# Altium schematic sheet JETSON AGX UPHY.SchDoc: Jetson AGX - UPHY
size 431 x 279 mm; CheckedBy: Lance Bantoto; Engineer: Cindy Li, Chealsie Bains; DocumentNumber: 9; Revision: 1; SheetNumber: 9; SheetTotal: 23
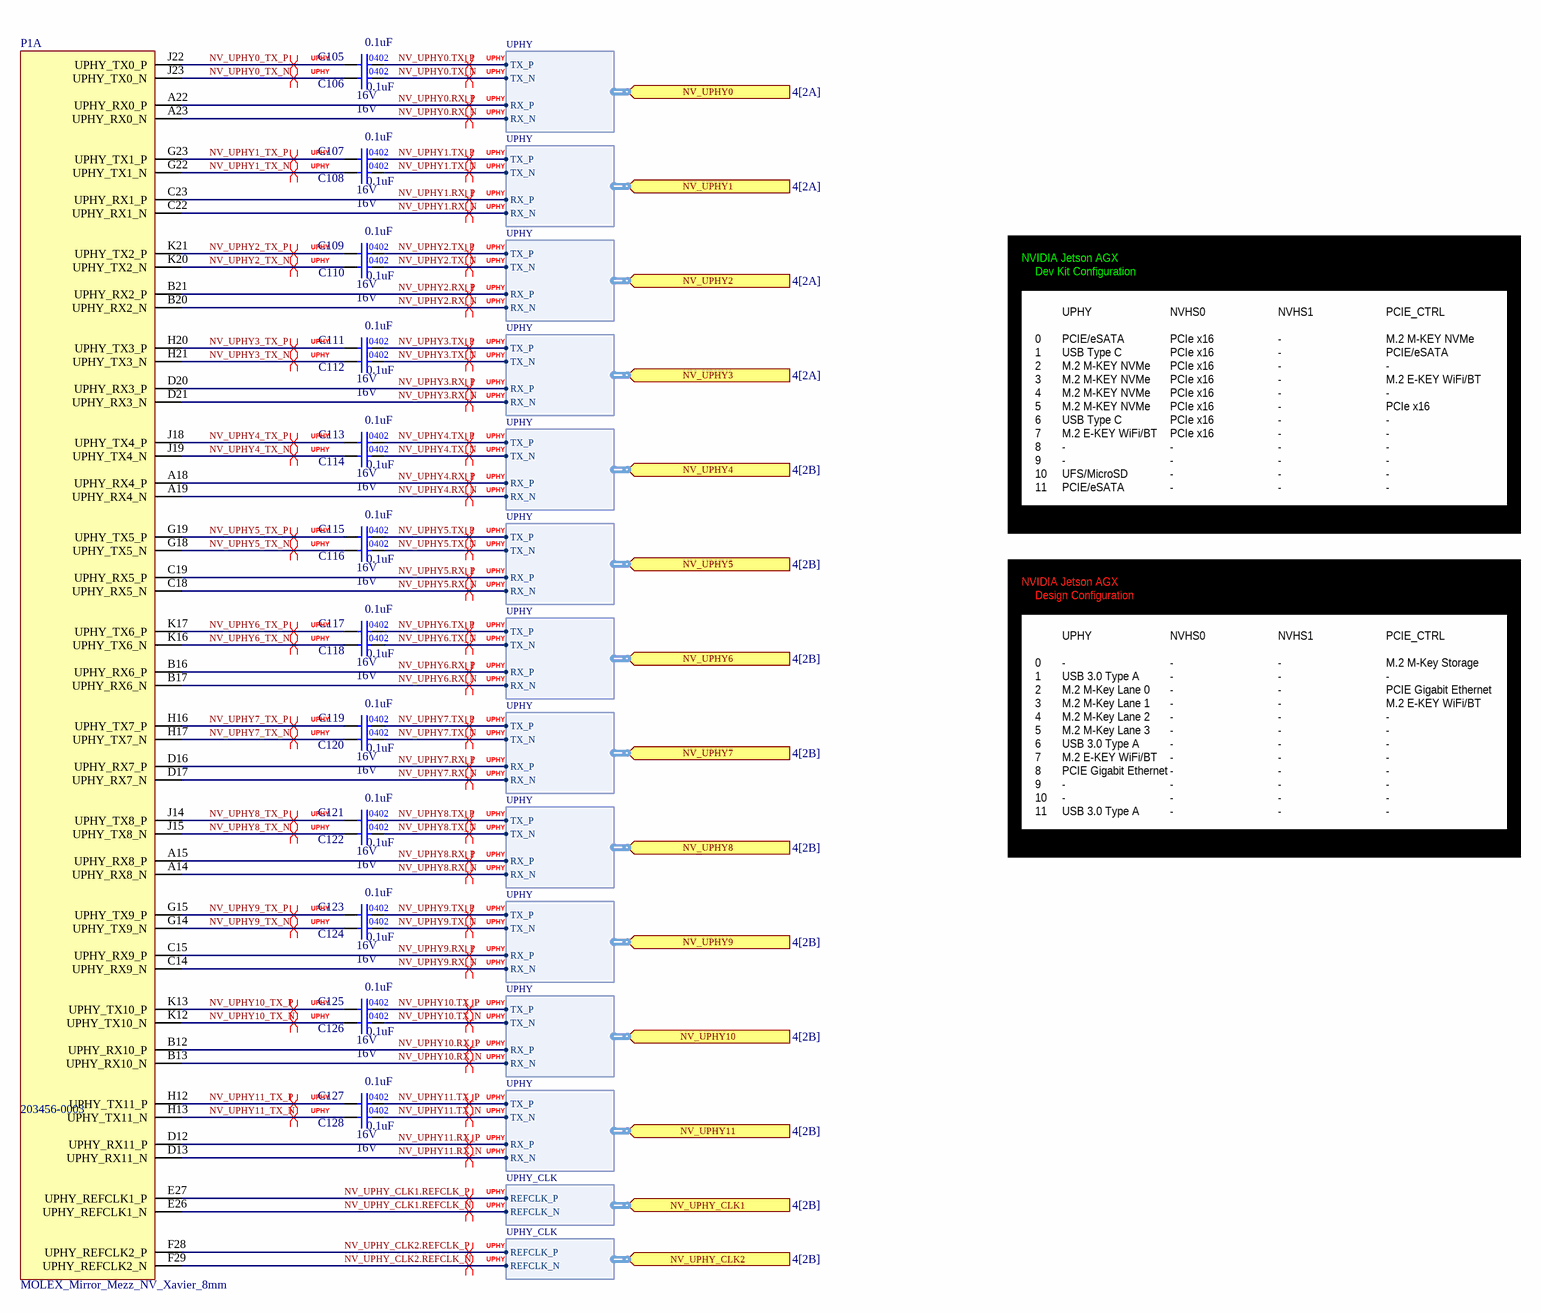
[diagram p0: JETSON AGX UPHY.SchDoc]

## Parts
C105  Capacitance: 0.1uF  Voltage Rating: 16V  [CAP0402]  (hidden comment: CAP_0.1uF_16V_X7R_0402)
C106  Capacitance: 0.1uF  Voltage Rating: 16V  [CAP0402]  (hidden comment: CAP_0.1uF_16V_X7R_0402)
C107  Capacitance: 0.1uF  Voltage Rating: 16V  [CAP0402]  (hidden comment: CAP_0.1uF_16V_X7R_0402)
C108  Capacitance: 0.1uF  Voltage Rating: 16V  [CAP0402]  (hidden comment: CAP_0.1uF_16V_X7R_0402)
C109  Capacitance: 0.1uF  Voltage Rating: 16V  [CAP0402]  (hidden comment: CAP_0.1uF_16V_X7R_0402)
C110  Capacitance: 0.1uF  Voltage Rating: 16V  [CAP0402]  (hidden comment: CAP_0.1uF_16V_X7R_0402)
C111  Capacitance: 0.1uF  Voltage Rating: 16V  [CAP0402]  (hidden comment: CAP_0.1uF_16V_X7R_0402)
C112  Capacitance: 0.1uF  Voltage Rating: 16V  [CAP0402]  (hidden comment: CAP_0.1uF_16V_X7R_0402)
C113  Capacitance: 0.1uF  Voltage Rating: 16V  [CAP0402]  (hidden comment: CAP_0.1uF_16V_X7R_0402)
C114  Capacitance: 0.1uF  Voltage Rating: 16V  [CAP0402]  (hidden comment: CAP_0.1uF_16V_X7R_0402)
C115  Capacitance: 0.1uF  Voltage Rating: 16V  [CAP0402]  (hidden comment: CAP_0.1uF_16V_X7R_0402)
C116  Capacitance: 0.1uF  Voltage Rating: 16V  [CAP0402]  (hidden comment: CAP_0.1uF_16V_X7R_0402)
C117  Capacitance: 0.1uF  Voltage Rating: 16V  [CAP0402]  (hidden comment: CAP_0.1uF_16V_X7R_0402)
C118  Capacitance: 0.1uF  Voltage Rating: 16V  [CAP0402]  (hidden comment: CAP_0.1uF_16V_X7R_0402)
C119  Capacitance: 0.1uF  Voltage Rating: 16V  [CAP0402]  (hidden comment: CAP_0.1uF_16V_X7R_0402)
C120  Capacitance: 0.1uF  Voltage Rating: 16V  [CAP0402]  (hidden comment: CAP_0.1uF_16V_X7R_0402)
C121  Capacitance: 0.1uF  Voltage Rating: 16V  [CAP0402]  (hidden comment: CAP_0.1uF_16V_X7R_0402)
C122  Capacitance: 0.1uF  Voltage Rating: 16V  [CAP0402]  (hidden comment: CAP_0.1uF_16V_X7R_0402)
C123  Capacitance: 0.1uF  Voltage Rating: 16V  [CAP0402]  (hidden comment: CAP_0.1uF_16V_X7R_0402)
C124  Capacitance: 0.1uF  Voltage Rating: 16V  [CAP0402]  (hidden comment: CAP_0.1uF_16V_X7R_0402)
C125  Capacitance: 0.1uF  Voltage Rating: 16V  [CAP0402]  (hidden comment: CAP_0.1uF_16V_X7R_0402)
C126  Capacitance: 0.1uF  Voltage Rating: 16V  [CAP0402]  (hidden comment: CAP_0.1uF_16V_X7R_0402)
C127  Capacitance: 0.1uF  Voltage Rating: 16V  [CAP0402]  (hidden comment: CAP_0.1uF_16V_X7R_0402)
C128  Capacitance: 0.1uF  Voltage Rating: 16V  [CAP0402]  (hidden comment: CAP_0.1uF_16V_X7R_0402)
P1  MOLEX_Mirror_Mezz_NV_Xavier_8mm  [203456-0003]  (part A of 15)

## Ports
NV_UPHY0 (in, harness UPHY, see 4[2A]), NV_UPHY1 (in, harness UPHY, see 4[2A]), NV_UPHY2 (in, harness UPHY, see 4[2A]), NV_UPHY3 (in, harness UPHY, see 4[2A]), NV_UPHY4 (in, harness UPHY, see 4[2B]), NV_UPHY5 (in, harness UPHY, see 4[2B]), NV_UPHY6 (in, harness UPHY, see 4[2B]), NV_UPHY7 (in, harness UPHY, see 4[2B]), NV_UPHY8 (in, harness UPHY, see 4[2B]), NV_UPHY9 (in, harness UPHY, see 4[2B]), NV_UPHY10 (in, harness UPHY, see 4[2B]), NV_UPHY11 (in, harness UPHY, see 4[2B]), NV_UPHY_CLK1 (in, harness UPHY_CLK, see 4[2B]), NV_UPHY_CLK2 (in, harness UPHY_CLK, see 4[2B])

## Harnesses
UPHY: TX_P, TX_N, RX_P, RX_N
UPHY_CLK: REFCLK_P, REFCLK_N

## Nets
NV_UPHY0.RX_N: P1.A23(UPHY_RX0_N) ; port NV_UPHY0.RX_N
NV_UPHY0.RX_P: P1.A22(UPHY_RX0_P) ; port NV_UPHY0.RX_P
NV_UPHY0.TX_N: C106.2 ; port NV_UPHY0.TX_N
NV_UPHY0.TX_P: C105.2 ; port NV_UPHY0.TX_P
NV_UPHY0_TX_N: C106.1 P1.J23(UPHY_TX0_N)
NV_UPHY0_TX_P: C105.1 P1.J22(UPHY_TX0_P)
NV_UPHY1.RX_N: P1.C22(UPHY_RX1_N) ; port NV_UPHY1.RX_N
NV_UPHY1.RX_P: P1.C23(UPHY_RX1_P) ; port NV_UPHY1.RX_P
NV_UPHY1.TX_N: C108.2 ; port NV_UPHY1.TX_N
NV_UPHY1.TX_P: C107.2 ; port NV_UPHY1.TX_P
NV_UPHY1_TX_N: C108.1 P1.G22(UPHY_TX1_N)
NV_UPHY1_TX_P: C107.1 P1.G23(UPHY_TX1_P)
NV_UPHY2.RX_N: P1.B20(UPHY_RX2_N) ; port NV_UPHY2.RX_N
NV_UPHY2.RX_P: P1.B21(UPHY_RX2_P) ; port NV_UPHY2.RX_P
NV_UPHY2.TX_N: C110.2 ; port NV_UPHY2.TX_N
NV_UPHY2.TX_P: C109.2 ; port NV_UPHY2.TX_P
NV_UPHY2_TX_N: C110.1 P1.K20(UPHY_TX2_N)
NV_UPHY2_TX_P: C109.1 P1.K21(UPHY_TX2_P)
NV_UPHY3.RX_N: P1.D21(UPHY_RX3_N) ; port NV_UPHY3.RX_N
NV_UPHY3.RX_P: P1.D20(UPHY_RX3_P) ; port NV_UPHY3.RX_P
NV_UPHY3.TX_N: C112.2 ; port NV_UPHY3.TX_N
NV_UPHY3.TX_P: C111.2 ; port NV_UPHY3.TX_P
NV_UPHY3_TX_N: C112.1 P1.H21(UPHY_TX3_N)
NV_UPHY3_TX_P: C111.1 P1.H20(UPHY_TX3_P)
NV_UPHY4.RX_N: P1.A19(UPHY_RX4_N) ; port NV_UPHY4.RX_N
NV_UPHY4.RX_P: P1.A18(UPHY_RX4_P) ; port NV_UPHY4.RX_P
NV_UPHY4.TX_N: C114.2 ; port NV_UPHY4.TX_N
NV_UPHY4.TX_P: C113.2 ; port NV_UPHY4.TX_P
NV_UPHY4_TX_N: C114.1 P1.J19(UPHY_TX4_N)
NV_UPHY4_TX_P: C113.1 P1.J18(UPHY_TX4_P)
NV_UPHY5.RX_N: P1.C18(UPHY_RX5_N) ; port NV_UPHY5.RX_N
NV_UPHY5.RX_P: P1.C19(UPHY_RX5_P) ; port NV_UPHY5.RX_P
NV_UPHY5.TX_N: C116.2 ; port NV_UPHY5.TX_N
NV_UPHY5.TX_P: C115.2 ; port NV_UPHY5.TX_P
NV_UPHY5_TX_N: C116.1 P1.G18(UPHY_TX5_N)
NV_UPHY5_TX_P: C115.1 P1.G19(UPHY_TX5_P)
NV_UPHY6.RX_N: P1.B17(UPHY_RX6_N) ; port NV_UPHY6.RX_N
NV_UPHY6.RX_P: P1.B16(UPHY_RX6_P) ; port NV_UPHY6.RX_P
NV_UPHY6.TX_N: C118.2 ; port NV_UPHY6.TX_N
NV_UPHY6.TX_P: C117.2 ; port NV_UPHY6.TX_P
NV_UPHY6_TX_N: C118.1 P1.K16(UPHY_TX6_N)
NV_UPHY6_TX_P: C117.1 P1.K17(UPHY_TX6_P)
NV_UPHY7.RX_N: P1.D17(UPHY_RX7_N) ; port NV_UPHY7.RX_N
NV_UPHY7.RX_P: P1.D16(UPHY_RX7_P) ; port NV_UPHY7.RX_P
NV_UPHY7.TX_N: C120.2 ; port NV_UPHY7.TX_N
NV_UPHY7.TX_P: C119.2 ; port NV_UPHY7.TX_P
NV_UPHY7_TX_N: C120.1 P1.H17(UPHY_TX7_N)
NV_UPHY7_TX_P: C119.1 P1.H16(UPHY_TX7_P)
NV_UPHY8.RX_N: P1.A14(UPHY_RX8_N) ; port NV_UPHY8.RX_N
NV_UPHY8.RX_P: P1.A15(UPHY_RX8_P) ; port NV_UPHY8.RX_P
NV_UPHY8.TX_N: C122.2 ; port NV_UPHY8.TX_N
NV_UPHY8.TX_P: C121.2 ; port NV_UPHY8.TX_P
NV_UPHY8_TX_N: C122.1 P1.J15(UPHY_TX8_N)
NV_UPHY8_TX_P: C121.1 P1.J14(UPHY_TX8_P)
NV_UPHY9.RX_N: P1.C14(UPHY_RX9_N) ; port NV_UPHY9.RX_N
NV_UPHY9.RX_P: P1.C15(UPHY_RX9_P) ; port NV_UPHY9.RX_P
NV_UPHY9.TX_N: C124.2 ; port NV_UPHY9.TX_N
NV_UPHY9.TX_P: C123.2 ; port NV_UPHY9.TX_P
NV_UPHY9_TX_N: C124.1 P1.G14(UPHY_TX9_N)
NV_UPHY9_TX_P: C123.1 P1.G15(UPHY_TX9_P)
NV_UPHY10.RX_N: P1.B13(UPHY_RX10_N) ; port NV_UPHY10.RX_N
NV_UPHY10.RX_P: P1.B12(UPHY_RX10_P) ; port NV_UPHY10.RX_P
NV_UPHY10.TX_N: C126.2 ; port NV_UPHY10.TX_N
NV_UPHY10.TX_P: C125.2 ; port NV_UPHY10.TX_P
NV_UPHY10_TX_N: C126.1 P1.K12(UPHY_TX10_N)
NV_UPHY10_TX_P: C125.1 P1.K13(UPHY_TX10_P)
NV_UPHY11.RX_N: P1.D13(UPHY_RX11_N) ; port NV_UPHY11.RX_N
NV_UPHY11.RX_P: P1.D12(UPHY_RX11_P) ; port NV_UPHY11.RX_P
NV_UPHY11.TX_N: C128.2 ; port NV_UPHY11.TX_N
NV_UPHY11.TX_P: C127.2 ; port NV_UPHY11.TX_P
NV_UPHY11_TX_N: C128.1 P1.H13(UPHY_TX11_N)
NV_UPHY11_TX_P: C127.1 P1.H12(UPHY_TX11_P)
NV_UPHY_CLK1.REFCLK_N: P1.E26(UPHY_REFCLK1_N) ; port NV_UPHY_CLK1.REFCLK_N
NV_UPHY_CLK1.REFCLK_P: P1.E27(UPHY_REFCLK1_P) ; port NV_UPHY_CLK1.REFCLK_P
NV_UPHY_CLK2.REFCLK_N: P1.F29(UPHY_REFCLK2_N) ; port NV_UPHY_CLK2.REFCLK_N
NV_UPHY_CLK2.REFCLK_P: P1.F28(UPHY_REFCLK2_P) ; port NV_UPHY_CLK2.REFCLK_P

## Layout directives
differential pair; differential pair class UPHY_CLK; differential pair class UPHY_CLK1: NV_UPHY_CLK1.REFCLK_N, NV_UPHY_CLK1.REFCLK_P
differential pair; differential pair class UPHY_CLK; differential pair class UPHY_CLK2: NV_UPHY_CLK2.REFCLK_N, NV_UPHY_CLK2.REFCLK_P
differential pair; differential pair class UPHY; differential pair class UPHY0: NV_UPHY0.RX_N, NV_UPHY0.RX_P, NV_UPHY0.TX_N, NV_UPHY0.TX_P, NV_UPHY0_TX_N, NV_UPHY0_TX_P
differential pair; differential pair class UPHY; differential pair class UPHY1: NV_UPHY1.RX_N, NV_UPHY1.RX_P, NV_UPHY1.TX_N, NV_UPHY1.TX_P, NV_UPHY1_TX_N, NV_UPHY1_TX_P
differential pair; differential pair class UPHY; differential pair class UPHY2: NV_UPHY2.RX_N, NV_UPHY2.RX_P, NV_UPHY2.TX_N, NV_UPHY2.TX_P, NV_UPHY2_TX_N, NV_UPHY2_TX_P
differential pair; differential pair class UPHY; differential pair class UPHY3: NV_UPHY3.RX_N, NV_UPHY3.RX_P, NV_UPHY3.TX_N, NV_UPHY3.TX_P, NV_UPHY3_TX_N, NV_UPHY3_TX_P
differential pair; differential pair class UPHY; differential pair class UPHY4: NV_UPHY4.RX_N, NV_UPHY4.RX_P, NV_UPHY4.TX_N, NV_UPHY4.TX_P, NV_UPHY4_TX_N, NV_UPHY4_TX_P
differential pair; differential pair class UPHY; differential pair class UPHY5: NV_UPHY5.RX_N, NV_UPHY5.RX_P, NV_UPHY5.TX_N, NV_UPHY5.TX_P, NV_UPHY5_TX_N, NV_UPHY5_TX_P
differential pair; differential pair class UPHY; differential pair class UPHY6: NV_UPHY6.RX_N, NV_UPHY6.RX_P, NV_UPHY6.TX_N, NV_UPHY6.TX_P, NV_UPHY6_TX_N, NV_UPHY6_TX_P
differential pair; differential pair class UPHY; differential pair class UPHY7: NV_UPHY7.RX_N, NV_UPHY7.RX_P, NV_UPHY7.TX_N, NV_UPHY7.TX_P, NV_UPHY7_TX_N, NV_UPHY7_TX_P
differential pair; differential pair class UPHY; differential pair class UPHY8: NV_UPHY8.RX_N, NV_UPHY8.RX_P, NV_UPHY8.TX_N, NV_UPHY8.TX_P, NV_UPHY8_TX_N, NV_UPHY8_TX_P
differential pair; differential pair class UPHY; differential pair class UPHY9: NV_UPHY9.RX_N, NV_UPHY9.RX_P, NV_UPHY9.TX_N, NV_UPHY9.TX_P, NV_UPHY9_TX_N, NV_UPHY9_TX_P
differential pair; differential pair class UPHY; differential pair class UPHY10: NV_UPHY10.RX_N, NV_UPHY10.RX_P, NV_UPHY10.TX_N, NV_UPHY10.TX_P, NV_UPHY10_TX_N, NV_UPHY10_TX_P
differential pair; differential pair class UPHY; differential pair class UPHY11: NV_UPHY11.RX_N, NV_UPHY11.RX_P, NV_UPHY11.TX_N, NV_UPHY11.TX_P, NV_UPHY11_TX_N, NV_UPHY11_TX_P

## Notes on the sheet
- NVIDIA Jetson AGX
- Dev Kit Configuration
- UPHY
- NVHS0
- NVHS1
- PCIE_CTRL
- 0
  1
  2
  3
  4
  5
  6
  7
  8
  9
  10
  11
- PCIE/eSATA
  USB Type C
  M.2 M-KEY NVMe
  M.2 M-KEY NVMe
  M.2 M-KEY NVMe
  M.2 M-KEY NVMe
  USB Type C
  M.2 E-KEY WiFi/BT
  -
  -
  UFS/MicroSD
  PCIE/eSATA
- PCIe x16
  PCIe x16
  PCIe x16
  PCIe x16
  PCIe x16
  PCIe x16
  PCIe x16
  PCIe x16
  -
  -
  -
  -
- -
  -
  -
  -
  -
  -
  -
  -
  -
  -
  -
  -
- M.2 M-KEY NVMe
  PCIE/eSATA
  -
  M.2 E-KEY WiFi/BT
  -
  PCIe x16
  -
  -
  -
  -
  -
  -
  -
- Design Configuration
- -
  USB 3.0 Type A
  M.2 M-Key Lane 0
  M.2 M-Key Lane 1
  M.2 M-Key Lane 2
  M.2 M-Key Lane 3
  USB 3.0 Type A
  M.2 E-KEY WiFi/BT
  PCIE Gigabit Ethernet
  -
  -
  USB 3.0 Type A
- M.2 M-Key Storage
  -
  PCIE Gigabit Ethernet
  M.2 E-KEY WiFi/BT
  -
  -
  -
  -
  -
  -
  -
  -
- University of Waterloo Robotics Team
- 200 University Ave W
- REV
- PROJECT
- Waterloo, Ontario, Canada
- N2L 3G1
- DOCUMENT
- ENGINEER
- REVIEWER
- MODIFIED
- SHEET
- OF

## Library data of the parts
C105-C128 = CAP_0.1uF_16V_X7R_0402: CAP CER 0.1UF 16V X7R 0402; Supplier 1: Digi-Key; Mounting Type: Surface Mount; Package: 0402
P1 = MOLEX_Mirror_Mezz_NV_Xavier_8mm: CONN SELF-MATE 699POS SMD GOLD; Manufacturer 1: Molex; Supplier 1: Digi-Key; Supplier Part Number 1: WM25528CT-ND; Manufacturer Part Number 1: 203456-0003